# EAGLE schematic Enclosure 130x95 BP-L (EAGLE 9.6.2)
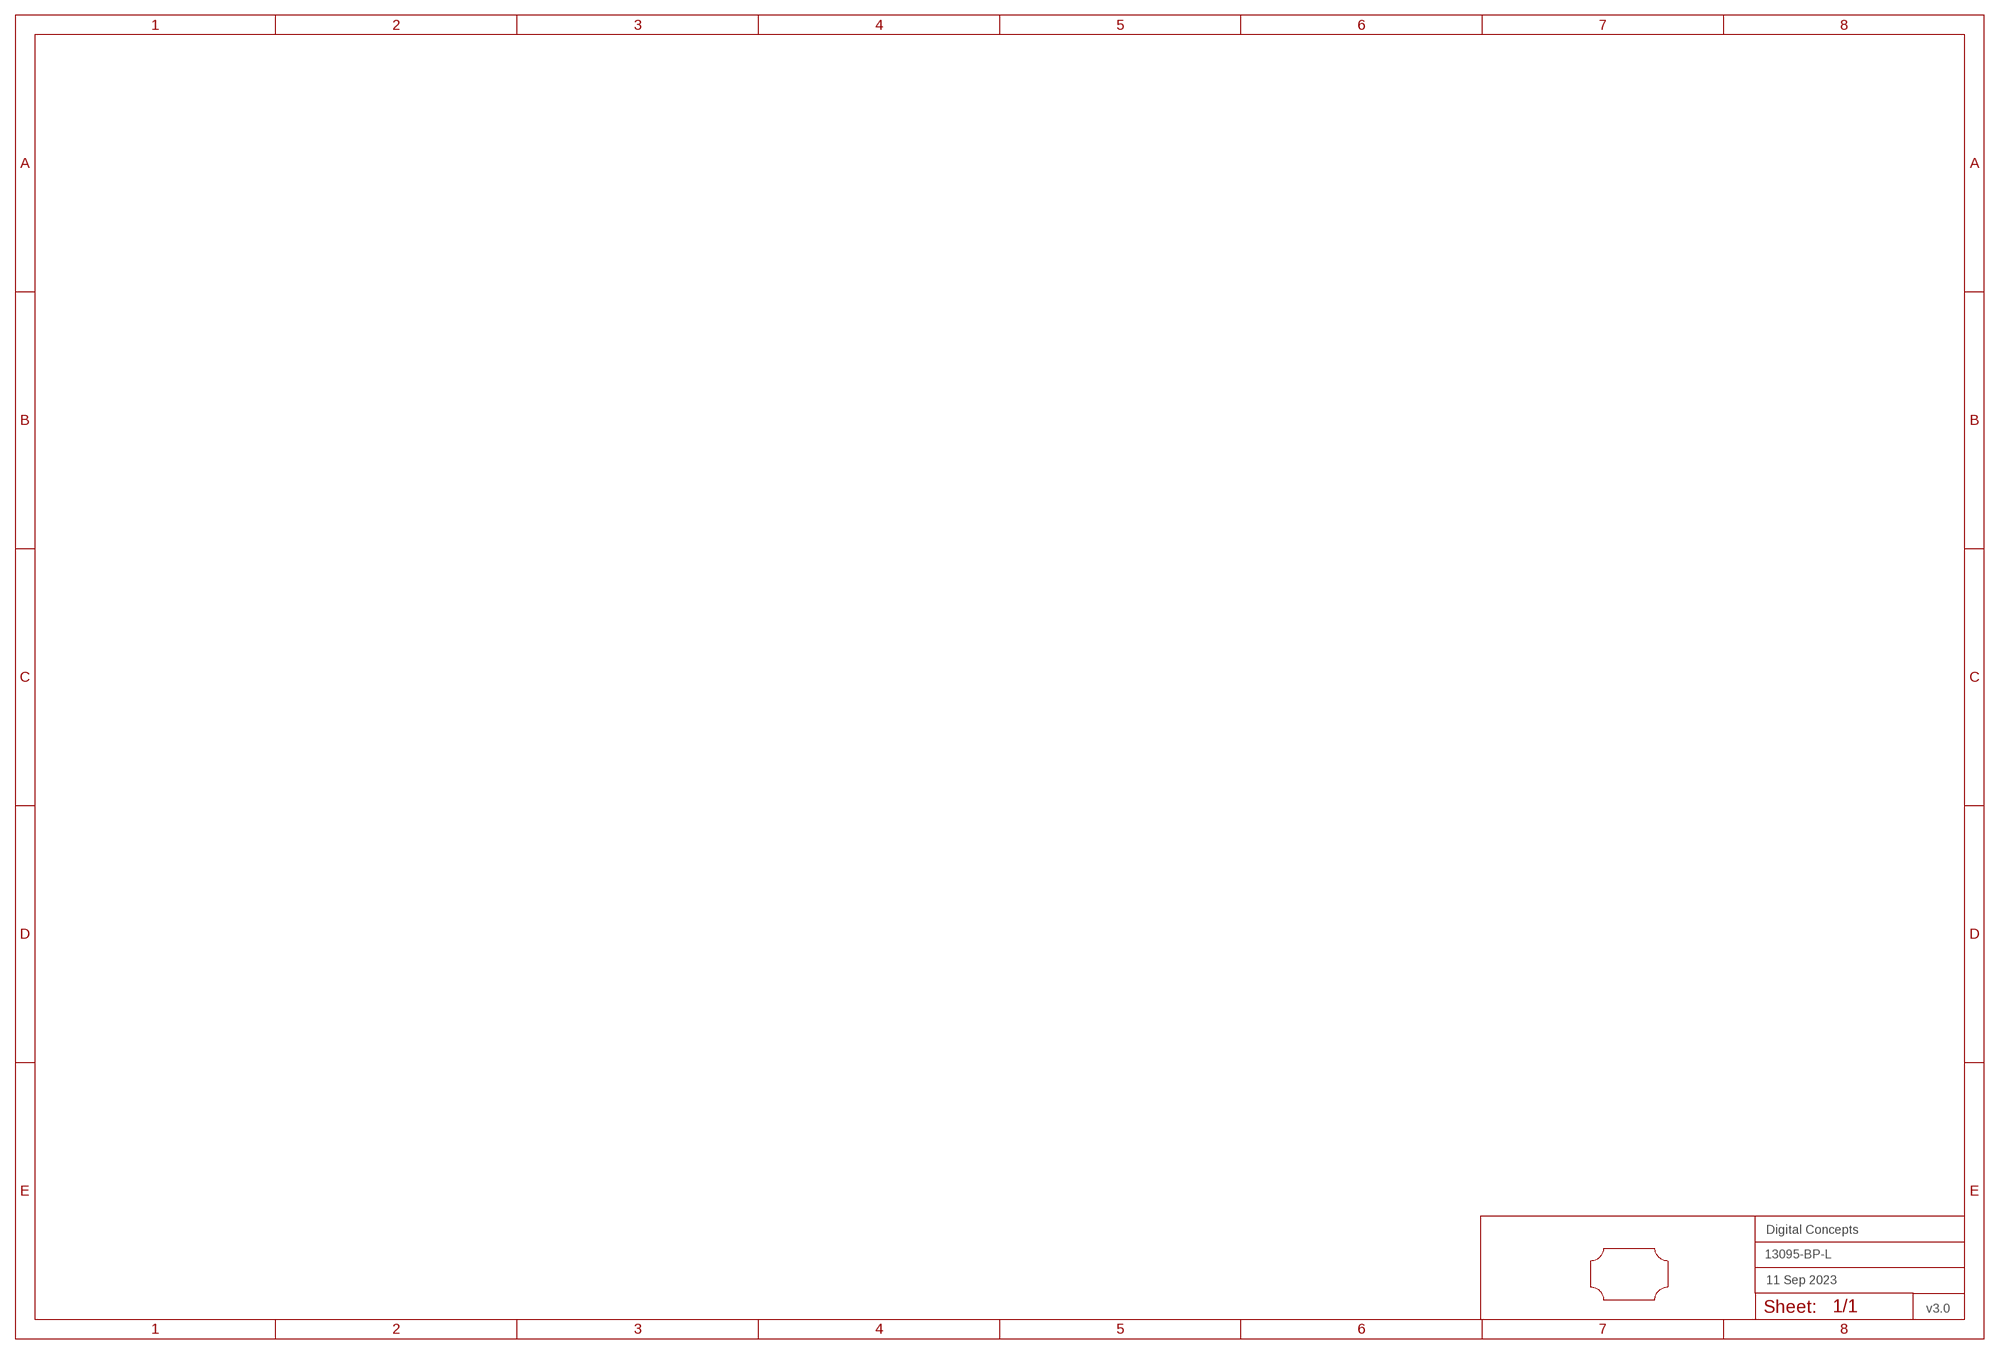
[diagram p0: schematic, sheet 1]
FRAME2 (A3L-LOC): DATE: 11 Sep 2023; OWNER: Digital Concepts; TITLE: 13095-BP-L; VERSION: v3.0

## Parts
U$1  PCB-OUTLINE-130X95-MAX-LC-H3  [PROTO-130X95-OUTLINE-MAX-LC-H3]

## Library data of the parts
U$1 = digitalconcepts:PCB-OUTLINE-130X95-MAX-LC-H3: PCB Eagle Max-Left-Cropped outline for 130 x 95 enclosure (Horizontal format)